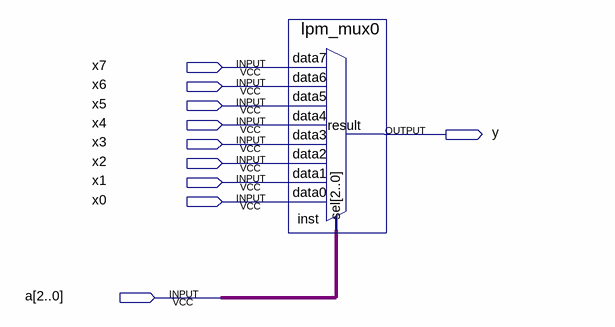
[diagram p0: schematic sheet]
// Quartus schematic Prac5.bdf as structural Verilog: 1 symbols, 10 pins
module Prac5 (
  input  x7,
  input  x6,
  input  x5,
  input  x4,
  input  x3,
  input  x2,
  input  x1,
  input  x0,
  input  [2:0] a,
  output y
);

  lpm_mux0 inst (
    .data7(x7), .data6(x6), .data5(x5), .data4(x4), .data3(x3), .data2(x2), .data1(x1), .data0(x0), .sel(a),
    .result(y));
endmodule
